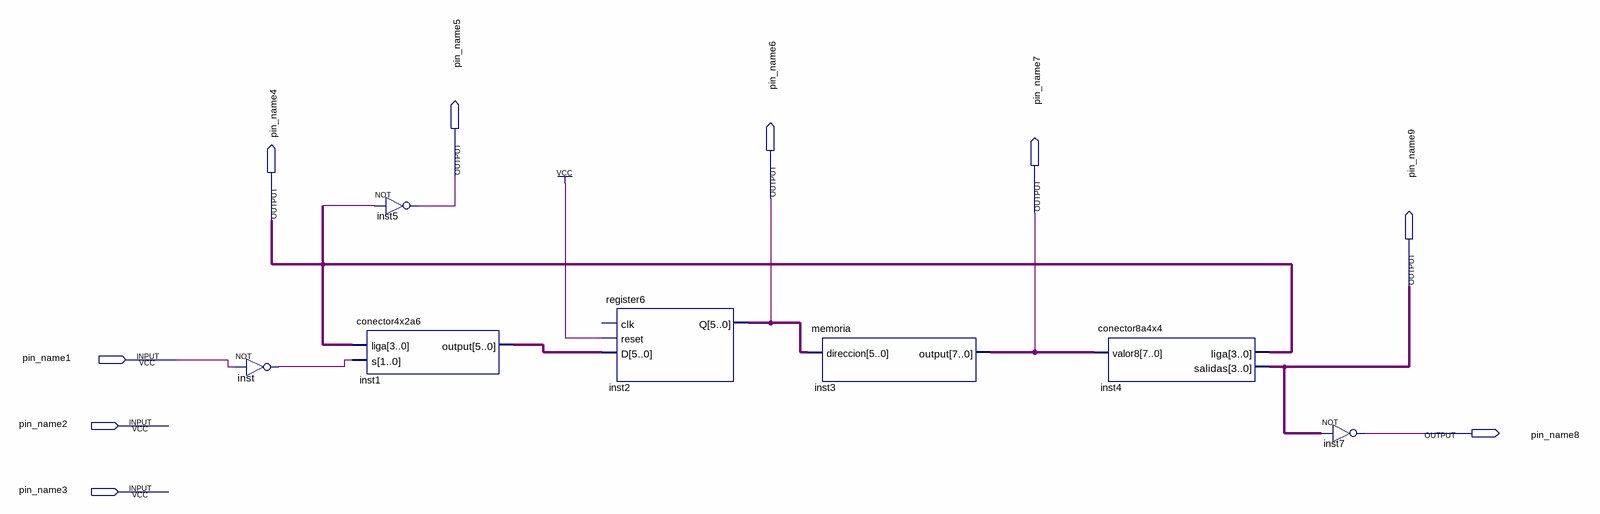
[diagram p0: schematic sheet]
// Quartus schematic Practica3.bdf as structural Verilog: 7 symbols, 9 pins
module Practica3 (
  input  pin_name1,
  input  pin_name2,
  input  pin_name3,
  output pin_name5,
  output pin_name6,
  output pin_name7,
  output pin_name4,
  output pin_name9,
  output pin_name8
);

  wire inst_out, undriven;
  wire [3:0] inst4_liga, inst4_salidas;
  wire [5:0] inst1_output, inst2_q;
  wire [7:0] inst3_output;

  not inst (inst_out, pin_name1);
  not inst5 (pin_name5, undriven);
  conector4x2a6 inst1 (.liga(inst4_liga), .s({2{inst_out}}), .\output (inst1_output));
  register6 inst2 (.reset(1'b1), .D(inst1_output), .Q(inst2_q));  // open: clk
  memoria inst3 (.direccion(inst2_q), .\output (inst3_output));
  conector8a4x4 inst4 (.valor8(inst3_output), .liga(inst4_liga), .salidas(inst4_salidas));
  assign pin_name8 = ~inst4_salidas;  // NOT inst7, 4 bits wide
endmodule
